# EAGLE design LEDboard (EAGLE 8.4.1)
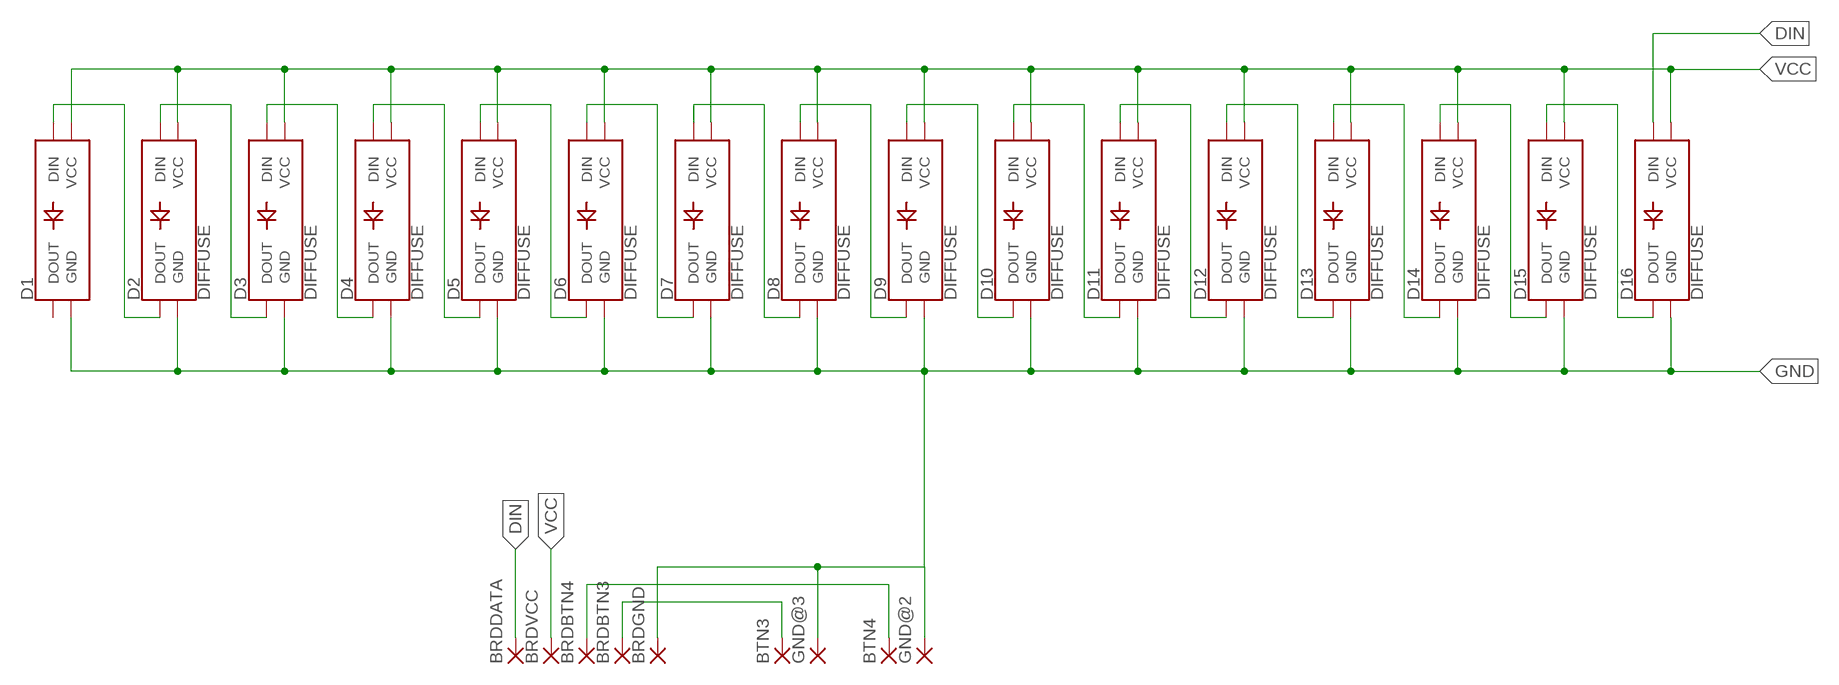
[diagram p0: schematic, sheet 1]

## Parts
BRDBTN3  SMD5  [SMD2,54-5,08]
BRDBTN4  SMD5  [SMD2,54-5,08]
BRDDATA  SMD5  [SMD2,54-5,08]
BRDGND  SMD5  [SMD2,54-5,08]
BRDVCC  SMD5  [SMD2,54-5,08]
BTN3  SMD5  [SMD2,54-5,08]
BTN4  SMD5  [SMD2,54-5,08]
D1  WS2812B_THT_ROUNDDIFFUSE  [WS2812B_THT_ROUND]
D2  DIFFUSE  WS2812B_THT_ROUNDDIFFUSE  [WS2812B_THT_ROUND]
D3  DIFFUSE  WS2812B_THT_ROUNDDIFFUSE  [WS2812B_THT_ROUND]
D4  DIFFUSE  WS2812B_THT_ROUNDDIFFUSE  [WS2812B_THT_ROUND]
D5  DIFFUSE  WS2812B_THT_ROUNDDIFFUSE  [WS2812B_THT_ROUND]
D6  DIFFUSE  WS2812B_THT_ROUNDDIFFUSE  [WS2812B_THT_ROUND]
D7  DIFFUSE  WS2812B_THT_ROUNDDIFFUSE  [WS2812B_THT_ROUND]
D8  DIFFUSE  WS2812B_THT_ROUNDDIFFUSE  [WS2812B_THT_ROUND]
D9  DIFFUSE  WS2812B_THT_ROUNDDIFFUSE  [WS2812B_THT_ROUND]
D10  DIFFUSE  WS2812B_THT_ROUNDDIFFUSE  [WS2812B_THT_ROUND]
D11  DIFFUSE  WS2812B_THT_ROUNDDIFFUSE  [WS2812B_THT_ROUND]
D12  DIFFUSE  WS2812B_THT_ROUNDDIFFUSE  [WS2812B_THT_ROUND]
D13  DIFFUSE  WS2812B_THT_ROUNDDIFFUSE  [WS2812B_THT_ROUND]
D14  DIFFUSE  WS2812B_THT_ROUNDDIFFUSE  [WS2812B_THT_ROUND]
D15  DIFFUSE  WS2812B_THT_ROUNDDIFFUSE  [WS2812B_THT_ROUND]
D16  DIFFUSE  WS2812B_THT_ROUNDDIFFUSE  [WS2812B_THT_ROUND]
GND@2  SMD5  [SMD2,54-5,08]
GND@3  SMD5  [SMD2,54-5,08]

## Nets
BTN3: BRDBTN3.1(P) BTN3.1(P)
BTN4: BRDBTN4.1(P) BTN4.1(P)
DIN: BRDDATA.1(P) D16.1(DIN)
GND: BRDGND.1(P) D1.3(GND) D2.3(GND) D3.3(GND) D4.3(GND) D5.3(GND) D6.3(GND) D7.3(GND) D8.3(GND) D9.3(GND) D10.3(GND) D11.3(GND) D12.3(GND) D13.3(GND) D14.3(GND) D15.3(GND) D16.3(GND) GND@2.1(P) GND@3.1(P)
N$1: D15.1(DIN) D16.4(DOUT)
N$2: D14.1(DIN) D15.4(DOUT)
N$3: D13.1(DIN) D14.4(DOUT)
N$4: D12.1(DIN) D13.4(DOUT)
N$5: D11.1(DIN) D12.4(DOUT)
N$6: D10.1(DIN) D11.4(DOUT)
N$7: D9.1(DIN) D10.4(DOUT)
N$8: D8.1(DIN) D9.4(DOUT)
N$9: D7.1(DIN) D8.4(DOUT)
N$10: D6.1(DIN) D7.4(DOUT)
N$11: D5.1(DIN) D6.4(DOUT)
N$12: D4.1(DIN) D5.4(DOUT)
N$13: D3.1(DIN) D4.4(DOUT)
N$14: D2.1(DIN) D3.4(DOUT)
N$15: D1.1(DIN) D2.4(DOUT)
VCC: BRDVCC.1(P) D1.2(VCC) D2.2(VCC) D3.2(VCC) D4.2(VCC) D5.2(VCC) D6.2(VCC) D7.2(VCC) D8.2(VCC) D9.2(VCC) D10.2(VCC) D11.2(VCC) D12.2(VCC) D13.2(VCC) D14.2(VCC) D15.2(VCC) D16.2(VCC)
Unconnected: D1.4(DOUT)

## Library data of the parts
BRDBTN3 BRDBTN4 BRDDATA BRDGND BRDVCC BTN3 BTN4 GND@2 GND@3 = wirepad:SMD5: SMD PAD
D1-D16 = Components:WS2812B_THT_ROUND

## Board
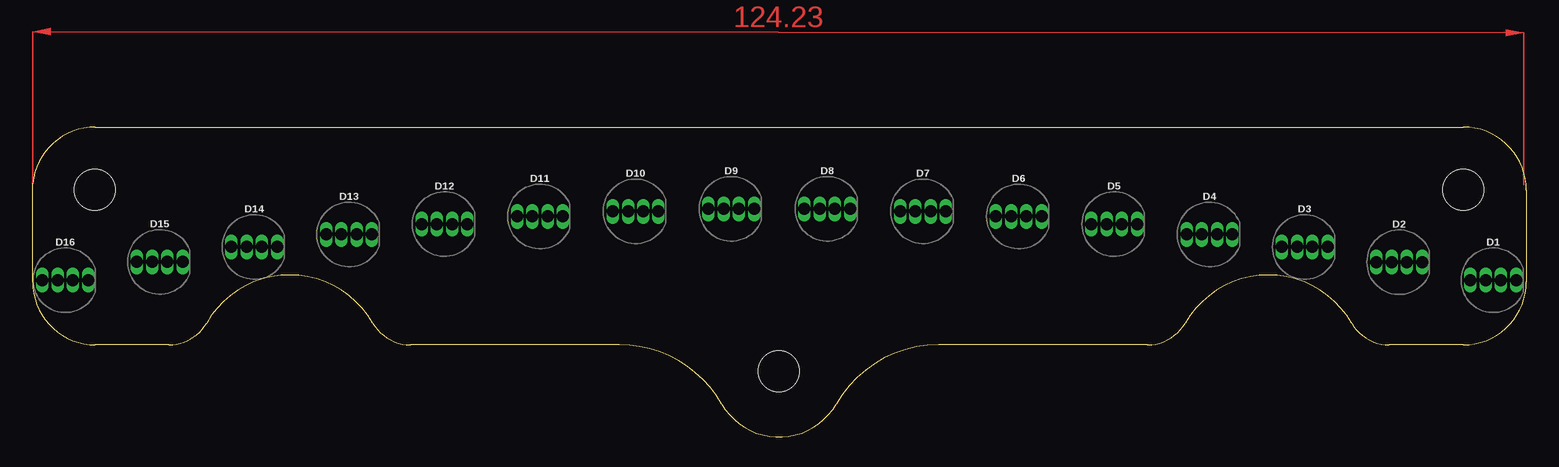
[diagram p1: board, top side]
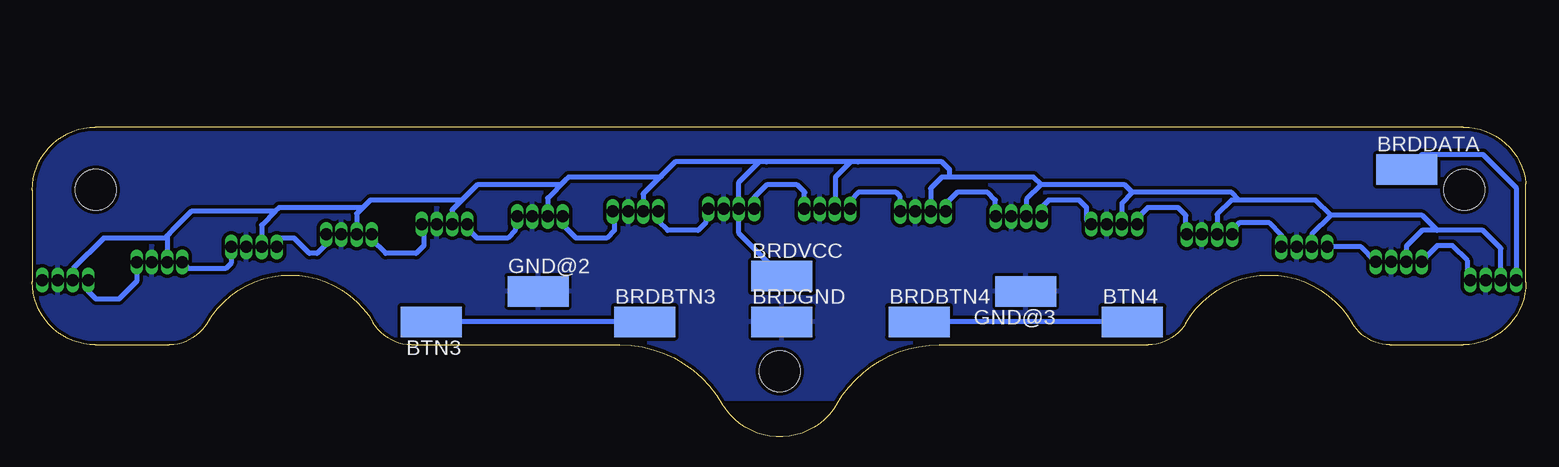
[diagram p2: board, bottom side, seen from below]

Size 124.47 x 25.82 mm. Coordinates in mm from the lower left corner, seen from the top.
Outline: 5.22,25.82 119.22,25.82 arc-90 124.47,20.57 124.47,12.93 arc-90 119.22,7.68 113.05,7.68 arc-60 109.9,9.49 arc120 96.04,9.49 arc-60 92.9,7.68 75.5,7.68 arc60 66.96,2.74 arc-120 57.43,2.74 arc60 48.89,7.68 31.49,7.68 arc-60 28.34,9.49 arc120 14.49,9.49 arc-60 11.34,7.68 5.22,7.68 arc-90 0,12.9 0,21.12 arc-84 5.22,25.82
Copper layers (1*16): Top 0.035mm / dielectric 1.5mm / Bottom 0.035mm
Design rules "default *": minimum track width 10mil, minimum drill 1mm, track to track 0.25mm, track to pad 0.25mm, pad to pad 0.25mm, via to via 0.25mm, smd to smd 0mil, copper to edge 6mil, drill to drill 6mil, minimum pad ring 0mil, minimum via ring 8mil, stop-mask expansion 4mil, vias tented up to drill 0mil, thermal gap 10mil
Holes 3.4 mm at 5.16,20.58 62.18,5.49 119.2,20.58

### Footprints (pad centres in the part's own frame; a part is rotated, then mirrored left to right if it is on the bottom)
SMD2,54-5,08 = smd 2.54 x 5.08: 1 0,0
WS2812B_THT_ROUND = drill 1 pad 1.016 long: 1 -1.905,0; 2 -0.635,0; 3 0.635,0; 4 1.905,0

### Placement (x,y rotation side)
BRDBTN3  73.43,9.58 270 bottom
BRDBTN4  50.57,9.58 270 bottom
BRDDATA  9.93,22.28 270 bottom
BRDGND  62,9.58 270 bottom
BRDVCC  62,13.39 270 bottom
BTN3  91.21,9.58 90 bottom
BTN4  32.79,9.58 270 bottom
D1  121.72,13.06 0 top
D2  113.87,14.56 0 top
D3  106,15.83 0 top
D4  98.07,16.87 0 top
D5  90.12,17.74 0 top
D6  82.17,18.37 0 top
D7  74.2,18.8 0 top
D8  66.22,19.01 0 top
D9  58.22,19.01 0 top
D10  50.24,18.8 0 top
D11  42.27,18.37 0 top
D12  34.32,17.74 0 top
D13  26.37,16.87 0 top
D14  18.47,15.83 0 top
D15  10.59,14.59 0 top
D16  2.72,13.06 0 top
GND@2  82.32,12.12 270 bottom
GND@3  41.68,12.12 90 bottom

### Tracks (layer width: path | path; a pad name or v marks a point on that pad's centre or on a via)
BTN3
  Bottom 0.406: BRDBTN3.1 BTN3.1
BTN4
  Bottom 0.406: BTN4.1 BRDBTN4.1
DIN
  Bottom 0.406: BRDDATA.1 8.66,23.55 3.58,23.55 0.82,20.78 D16.1
GND
  pour Bottom (isolate 0.3): -0.23,3.23 -0.23,28.63 124.23,28.63 124.23,3.23
N$1
  Bottom 0.406: D16.4 4.85,13.29 4.85,14.66 6.12,15.93 7.39,15.93 8.69,14.64 D15.1
N$2
  Bottom 0.406: D15.4 13.74,15.83 D14.1
N$3
  Bottom 0.406: D14.4 20.37,16.85 21.36,17.84 23.9,17.84 24.54,17.2 24.54,16.95 D13.1
N$4
  Bottom 0.406: D13.4 28.35,16.95 28.35,18.47 28.98,19.11 31.52,19.11 32.41,18.22 D12.1
N$5
  Bottom 0.406: D12.4 36.6,18.12 36.6,19.11 37.24,19.74 39.78,19.74 40.36,19.16 D11.1
N$6
  Bottom 0.406: D11.4 44.22,18.42 44.22,19.74 44.86,20.38 47.4,20.38 48.34,19.44 D10.1
N$7
  Bottom 0.406: D10.4 52.15,20.05 52.48,20.38 55.65,20.38 56.29,19.74 56.29,19.03 D9.1
N$8
  Bottom 0.406: D9.4 60.12,20.35 60.1,20.38 60.73,21.01 63.27,21.01 64.32,19.97 D8.1
N$9
  Bottom 0.406: D8.4 68.35,18.78 68.35,17.84 68.99,17.2 71.53,17.2 72.29,17.97 D7.1
N$10
  Bottom 0.406: D7.4 75.97,18.68 75.97,17.2 76.61,16.57 79.15,16.57 80.27,17.69 D6.1
N$11
  Bottom 0.406: D6.4 84.23,18.22 84.23,17.2 84.86,16.57 87.4,16.57 88.22,17.38 D5.1
N$12
  Bottom 0.406: D5.4 91.85,17.56 91.85,15.93 92.48,15.3 95.02,15.3 96.17,16.44 D4.1
N$13
  Bottom 0.406: D4.4 99.98,16.06 100.1,15.93 100.74,15.3 101.37,15.3 102.64,16.57 103.91,16.57 104.09,16.39 D3.1
N$14
  Bottom 0.406: D3.4 107.9,14.49 108.36,14.03 111.43,14.03 D2.1
N$15
  Bottom 0.406: D2.4 115.78,12.96 117.25,11.49 119.15,11.49 119.81,12.15 D1.1
VCC
  Bottom 0.406: D16.2 2.09,15.7 3.58,17.2 7.39,17.2 | 7.39,17.2 8.66,17.2 9.96,15.91 D15.2 | 7.39,17.2 8.66,18.47 16.28,18.47 | 16.28,18.47 17.83,16.92 D14.2 | 16.28,18.47 17.55,19.74 23.9,19.74 | 23.9,19.74 24.54,19.74 25.73,18.55 D13.2 | 23.9,19.74 24.54,20.38 32.79,20.38 | 32.79,20.38 33.68,19.49 D12.2 | 32.79,20.38 33.43,21.01 40.41,21.01 | 40.41,21.01 41.63,19.79 D11.2 | 40.41,21.01 41.05,21.65 48.03,21.65 | 48.03,21.65 48.67,21.65 49.61,20.71 D10.2 | 48.03,21.65 48.03,22.28 48.67,22.92 55.65,22.92 | 55.65,22.92 56.29,22.92 57.56,21.65 57.56,19.03 D9.2 | 55.65,22.92 63.27,22.92 | 63.27,22.92 63.91,22.92 65.59,21.24 D8.2 65.59,16.97 BRDVCC.1 | 63.27,22.92 70.89,22.92 71.85,21.97 | 71.85,21.97 73.56,20.25 D7.2 | 71.85,21.97 72.16,21.65 79.78,21.65 80.1,21.33 | 80.1,21.33 81.54,19.9 D6.2 | 80.1,21.33 80.42,21.01 87.4,21.01 88.67,19.74 | 88.67,19.74 89.49,18.93 D5.2 | 88.67,19.74 96.29,19.74 | 96.29,19.74 97.44,18.6 D4.2 | 96.29,19.74 96.93,19.11 103.91,19.11 104.23,18.79 | 104.23,18.79 105.36,17.66 D3.2 | 104.23,18.79 111.22,18.79 112.8,17.2 | D2.2 113.24,16.77 112.8,17.2 | 112.8,17.2 113.44,16.57 118.52,16.57 121.08,14 D1.2
(copper drawn outside any net)
  shapes: Top area x1